# Altium schematic sheet Temperature Controller.SchDoc: ESP32-C3 Rack Fan Controller
size 297 x 209 mm; DocumentNumber: SP-8001; SheetNumber: 1; SheetTotal: 1
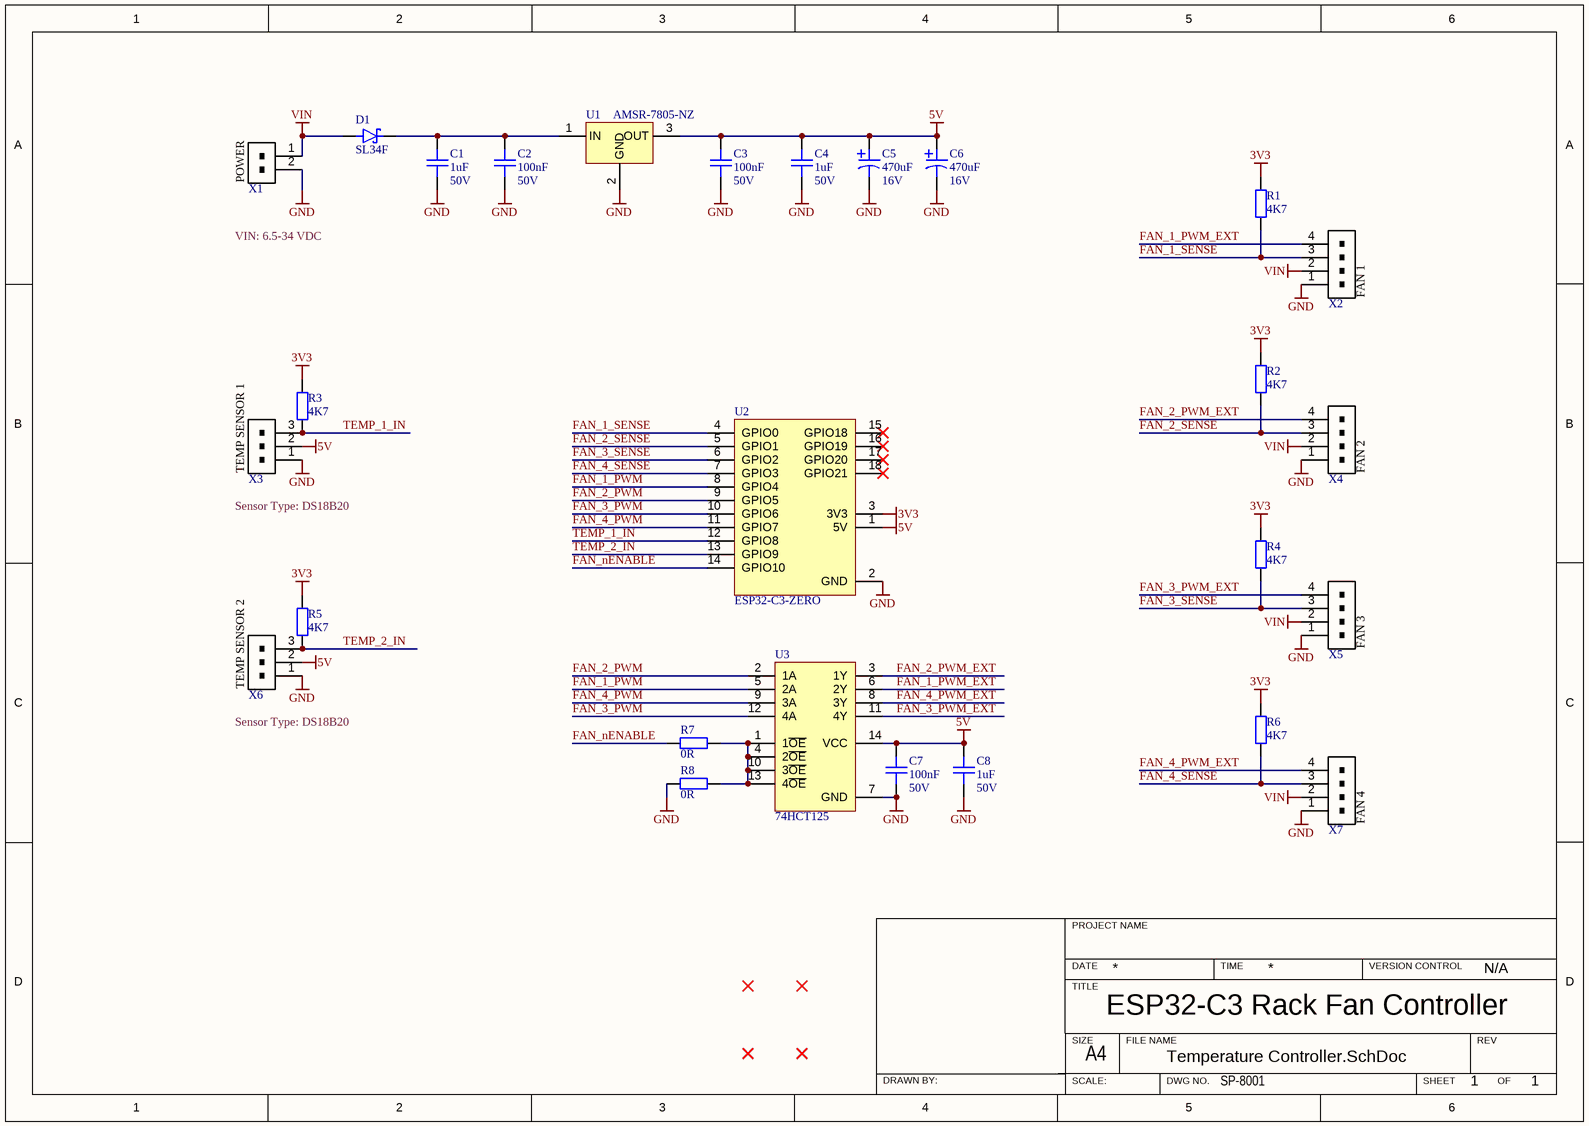
[diagram p0: Temperature Controller.SchDoc]

## Parts
C1  1uF  Voltage: 50V  [CAP-0805]
C2  100nF  Voltage: 50V  [CAP-0805]
C3  100nF  Voltage: 50V  [CAP-0805]
C4  1uF  Voltage: 50V  [CAP-0805]
C5  Voltage: 16V  [CAP-ELCO-SMD-FK1]  (hidden comment: 470uF)
C6  Voltage: 16V  [CAP-ELCO-SMD-FK1]  (hidden comment: 470uF)
C7  100nF  Voltage: 50V  [CAP-0805]
C8  1uF  Voltage: 50V  [CAP-0805]
D1  SL34F  [D-SMAF]
MH1  MECH-SCREW  [MECH-M3-LARGE-EMPTY-DOUBLE-SUPPORT]  (value not drawn)
MH2  MECH-SCREW  [MECH-M3-LARGE-EMPTY-DOUBLE-SUPPORT]  (value not drawn)
MH3  MECH-SCREW  [MECH-M3-LARGE-EMPTY-DOUBLE-SUPPORT]  (value not drawn)
MH4  MECH-SCREW  [MECH-M3-LARGE-EMPTY-DOUBLE-SUPPORT]  (value not drawn)
R1  4K7  [RES-0805]
R2  4K7  [RES-0805]
R3  4K7  [RES-0805]
R4  4K7  [RES-0805]
R5  4K7  [RES-0805]
R6  4K7  [RES-0805]
R7  0R  [RES-0805]
R8  0R  [RES-0805]
U1  AMSR-7805-NZ  [IC-AMS-7805]
U2  ESP32-C3-ZERO  [MOD-ESP32-C3-ZERO]  (no BOM)
U3  74HCT125  [IC-SOIC-14]
X1  CONN-2P  [CONN-2P-TERMINAL]  (value not drawn)
X2  CONN-4P  [CONN-4P-NCW254]  (value not drawn)
X3  CONN-3P  [CONN-3P-NCW254]  (value not drawn)
X4  CONN-4P  [CONN-4P-NCW254]  (value not drawn)
X5  CONN-4P  [CONN-4P-NCW254]  (value not drawn)
X6  CONN-3P  [CONN-3P-NCW254]  (value not drawn)
X7  CONN-4P  [CONN-4P-NCW254]  (value not drawn)

## Nets
3V3: R1.2 R2.2 R3.2 R4.2 R5.2 R6.2 U2.3(3V3)
5V: C3.2 C4.2 C5.2 C6.2 C7.2 C8.2 U1.3(OUT) U2.1(5V) U3.14(VCC) X3.2 X6.2
GND: C1.1 C2.1 C3.1 C4.1 C5.1 C6.1 C7.1 C8.1 R8.1 U1.2(GND) U2.2(GND) U3.7(GND) X1.2 X2.1 X3.1 X4.1 X5.1 X6.1 X7.1
VIN: D1.A X1.1 X2.2 X4.2 X5.2 X7.2
FAN_1_PWM: U2.8(GPIO4) U3.5(2A)
FAN_1_PWM_EXT: U3.6(2Y) X2.4
FAN_1_SENSE: R1.1 U2.4(GPIO0) X2.3
FAN_2_PWM: U2.9(GPIO5) U3.2(1A)
FAN_2_PWM_EXT: U3.3(1Y) X4.4
FAN_2_SENSE: R2.1 U2.5(GPIO1) X4.3
FAN_3_PWM: U2.10(GPIO6) U3.12(4A)
FAN_3_PWM_EXT: U3.11(4Y) X5.4
FAN_3_SENSE: R4.1 U2.6(GPIO2) X5.3
FAN_4_PWM: U2.11(GPIO7) U3.9(3A)
FAN_4_PWM_EXT: U3.8(3Y) X7.4
FAN_4_SENSE: R6.1 U2.7(GPIO3) X7.3
FAN_nENABLE: R7.1 U2.14(GPIO10)
TEMP_1_IN: R3.1 U2.12(GPIO8) X3.3
TEMP_2_IN: R5.1 U2.13(GPIO9) X6.3
NetC1_2: C1.2 C2.2 D1.K U1.1(IN)
NetR7_2: R7.2 R8.2 U3.1(1~{OE}) U3.4(2~{OE}) U3.10(3~{OE}) U3.13(4~{OE})

Not connected (* = marked no-connect by the designer): MH1 MH(Con)*; MH2 MH(Con)*; MH3 MH(Con)*; MH4 MH(Con)*; U2 15(GPIO18)* 16(GPIO19)* 17(GPIO20)* 18(GPIO21)*

## Notes on the sheet
- (near X1) POWER
- VIN: 6.5-34 VDC
- (near X2) FAN 1
- (near X3) TEMP SENSOR 1
- (near X4) FAN 2
- (near X3) Sensor Type: DS18B20
- (near X5) FAN 3
- (near X6) Sensor Type: DS18B20
- (near X6) TEMP SENSOR 2
- (near X7) FAN 4
- PROJECT NAME
- DATE
- TITLE
- TIME
- VERSION CONTROL
- N/A
- SIZE
- SCALE:
- A4
- FILE NAME
- DWG NO.
- SHEET
- REV
- OF
- DRAWN BY:

## Library data of the parts
C1 C4 C8 = SPN-RES-6099: Capacitor Non-Polar; Tolerance: X7R; Value: 1uF; Distributor: Lomex; Order number: 82-10-21; Internal ID: SPN-RES-6099
C2 C3 C7 = SPN-RES-6084: Capacitor Non-Polar; Tolerance: X7R; Value: 100nF; Distributor: Lomex; Order number: 82-13-46; Internal ID: SPN-RES-6084
C5 C6 = SPN-RES-6223: 470uF 16V; Distributor: Lomex; Order number: 91-01-32; Value: 470uF; Internal ID: SPN-RES-6223
D1 = SPN-DIO-0204: 3A 40V SCH.RECT. Vf=0.45V; Distributor: Lomex; Order number: 83-07-60; Internal ID: SPN-DIO-0204; Value: SL34F; Link: https://lomex.hu/pdf/(yet)_sl34f%20thru%20sl310f.pdf
MH1-MH4 = SPN-CON-0000.32: M3, large ring, double support silkscreen; Value: M3 hole; Distributor: N/A; Order number: N/A; Internal ID: SPN-CON-0000.32
R1-R6 = SPN-RES-5313: Resistor; Internal ID: SPN-RES-5313; Value: 4K7; Order number: 80-10-94; Distributor: Lomex
R7 R8 = SPN-RES-5161: Resistor; Internal ID: SPN-RES-5161; Value: 0R; Order number: 81-10-02; Distributor: Lomex
U1 = SPN-MOD-0012: Converter: DC/DC, 2.5W, Uin: 6.5-32V, Uout: 5VDC, Iout: 500mA; Order number: AMSR-7805Z; Internal ID: SPN-MOD-0012; Value: AMSR-7805-NZ; Distributor: TME; Link: https://www.tme.eu/hu/details/amsr-7805z/dc-dc-konverterek/aimtec/
U2 = SPN-MOD-0433: ESP32-C3 mini fejlesztőkártya, ESP32-C3FN4, egymagos processzor, 160 MHz, 2,4 GHz Wi-Fi, Bluetooth 5; Order number: 100.466.42; Internal ID: SPN-MOD-0433; Value: ESP32-C3-ZERO; Distributor: Hestore; Link: https://www.hestore.hu/prod_10046642.html#
U3 = SPN-ICS-0434: QUADRUPLE BUS BUFFER GATES / WITH 3-STATE OUTPUTS; Order number: 100.215.75; Internal ID: SPN-ICS-0434; Value: 74HCT125; Distributor: Hestore; Link: https://www.hestore.hu/prod_10021575.html
X1 = SPN-CON-0315: SORKAPOCS 2 P RM3.50 TL002V-02P (TLM) LIFTES 1.5qmm 10A 130V VDE; Distributor: Lomex; Order number: 43-22-49; Internal ID: SPN-CON-0315; Value: TL002V-02P; Link: https://lomex.hu/pdf/(tlm)_tl002v-xp-xs.pdf
X2 X4 X5 X7 = SPN-CON-0429: TÁPCSATL. 2.54mm 4P APA 90° REVERSE NCW254-04RR (G-S) FORR.; Distributor: Lomex; Order number: 43-18-04; Internal ID: SPN-CON-0429; Value: NCW254-04RR; Link: https://lomex.hu/pdf/t-t/(t-t)_ncw254-xxrr.pdf
X3 X6 = SPN-CON-0428: TÁPCSATL. 2.54mm 3P APA 90° REVERSE NCW254-03RR (G-S) FORR.; Distributor: Lomex; Order number: 43-18-03; Internal ID: SPN-CON-0428; Value: NCW254-03RR; Link: https://lomex.hu/pdf/t-t/(t-t)_ncw254-xxrr.pdf